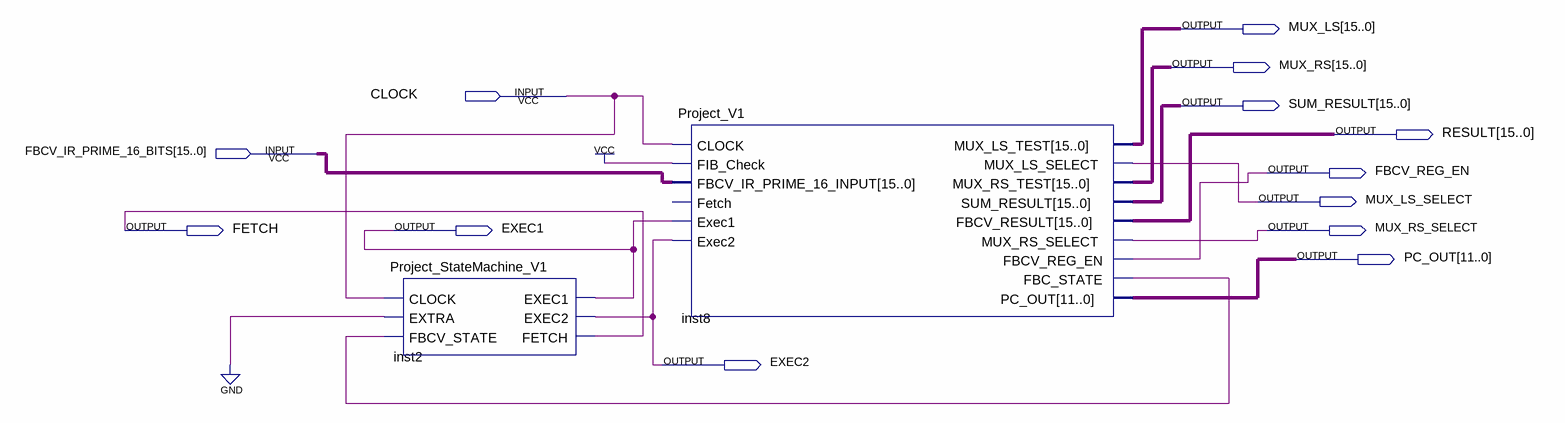
[diagram p0: schematic sheet]
// Quartus schematic FBCV_Testing_V1.bdf as structural Verilog: 2 symbols, 13 pins
module FBCV_Testing_V1 (
  input  CLOCK,
  input  [15:0] FBCV_IR_PRIME_16_BITS,
  output [15:0] MUX_LS,
  output [15:0] MUX_RS,
  output [15:0] SUM_RESULT,
  output [15:0] RESULT,
  output FBCV_REG_EN,
  output MUX_LS_SELECT,
  output FETCH,
  output EXEC1,
  output MUX_RS_SELECT,
  output [11:0] PC_OUT,
  output EXEC2
);

  wire inst8_fbc_state;

  Project_StateMachine_V1 inst2 (
    .CLOCK(CLOCK), .EXTRA(1'b0), .FBCV_STATE(inst8_fbc_state), .EXEC1(EXEC1), .EXEC2(EXEC2), .FETCH(FETCH));
  Project_V1 inst8 (
    .CLOCK(CLOCK), .FIB_Check(1'b1), .FBCV_IR_PRIME_16_INPUT(FBCV_IR_PRIME_16_BITS), .Exec1(EXEC1),
    .Exec2(EXEC2), .MUX_LS_TEST(MUX_LS), .MUX_LS_SELECT(MUX_LS_SELECT), .MUX_RS_TEST(MUX_RS),
    .SUM_RESULT(SUM_RESULT), .FBCV_RESULT(RESULT), .MUX_RS_SELECT(MUX_RS_SELECT), .FBCV_REG_EN(FBCV_REG_EN),
    .FBC_STATE(inst8_fbc_state), .PC_OUT(PC_OUT));  // open: Fetch
endmodule
